# EAGLE design untitled (EAGLE 6.1)
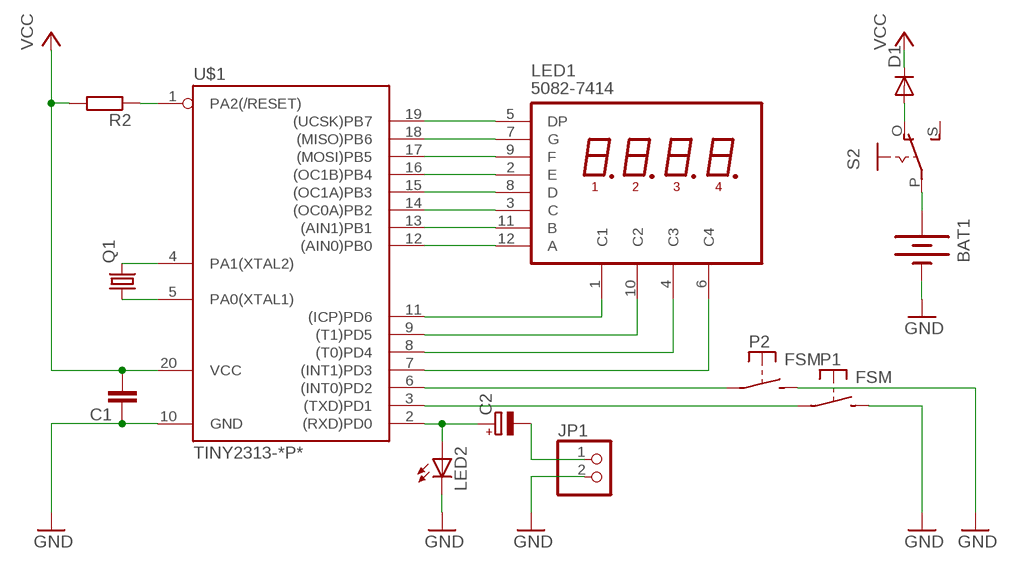
[diagram p0: schematic, sheet 1]

## Parts
BAT1  BATTERYAA-PANEL  [BATTERY-AA-PANEL]
C1  C-EU025-024X044  [C025-024X044]
C2  CPOL-EUE2,5-6E  [E2,5-6E]
D1  DIODE-D-5  [D-5]
JP1  PINHD-1X2  [1X02]
LED1  5082-7414  [5082-7414]
LED2  LED5MM  [LED5MM]
P1  FSM  [FSM]
P2  FSM  [FSM]
Q1  CRYSTALTC26H  [TC26H]
R2  R-EU_0204/7  [0204/7]
S2  EG1218S  [EG1218]
U$1  TINY2313-*P*  [DIL20]

## Nets
GND: BAT1.- C1.1 JP1.2 LED2.K(C) P1.P$2(S) P2.P$2(S) U$1.10(GND)
N$1: LED1.5(DP) U$1.19((UCSK)PB7)
N$2: LED1.7(G) U$1.18((MISO)PB6)
N$3: LED1.9(F) U$1.17((MOSI)PB5)
N$4: LED1.2(E) U$1.16((OC1B)PB4)
N$5: LED1.8(D) U$1.15((OC1A)PB3)
N$6: LED1.3(C) U$1.14((OC0A)PB2)
N$7: LED1.11(B) U$1.13((AIN1)PB1)
N$8: LED1.12(A) U$1.12((AIN0)PB0)
N$9: LED1.1(C1) U$1.11((ICP)PD6)
N$10: LED1.10(C2) U$1.9((T1)PD5)
N$11: LED1.4(C3) U$1.8((T0)PD4)
N$12: LED1.6(C4) U$1.7((INT1)PD3)
N$13: Q1.2 U$1.4(PA1(XTAL2))
N$14: Q1.1 U$1.5(PA0(XTAL1))
N$15: P2.P$1(P) U$1.6((INT0)PD2)
N$16: P1.P$1(P) U$1.3((TXD)PD1)
N$17: R2.1 U$1.1(PA2(/RESET))
N$18: BAT1.+ S2.P
N$19: C2.+ LED2.A U$1.2((RXD)PD0)
N$20: C2.- JP1.1
N$21: D1.A S2.O
VCC: C1.2 D1.C R2.2 U$1.20(VCC)
Unconnected: S2.S

## Library data of the parts
BAT1 = _MY_OWN_LIB:BATTERY: Battery Holders Various common sizes : AA, AAA, 20mm coin cell and 12mm coin cell.
C1 = rcl:C-EU: CAPACITOR, European symbol
C2 = rcl:CPOL-EU: POLARIZED CAPACITOR, European symbol
D1 = diode:DIODE-: DIODE
JP1 = pinhead:PINHD-1X2: PIN HEADER
LED1 = hp-displays:5082-7414: 4 digits X 7-segment + DP LED display
LED2 = led:LED: LED OSRAM: - CHIPLED LG R971, LG N971, LY N971, LG Q971, LY Q971, LO R971, LY R971 LH N974, LH R974 LS Q976, LO Q976, LY Q976 LO Q996 - Hyper CHIPLED LW Q18S LB Q993, LB Q99A, LB R99A - SideLED LS A670, LO A670, LY A670, LG A670, LP A670 LB A673, LV A673, LT A673, LW A673 LH A674 LY A675 LS A676, LA A676, LO A676, LY A676, LW A676 LS A679, LY A679, LG A679 - Hyper Micro SIDELED® LS Y876, LA Y876, LO Y876, LY Y876 LT Y87S - SmartLED LW L88C, LW L88S LB L89C, LB L89S, LG L890 LS L89K, LO L89K, LY L89K LS L896, LA L896, LO L896, LY L896 - TOPLED LS T670, LO T670, LY T670, LG T670, LP T670 LSG T670, LSP T670, LSY T670, LOP T670, LYG T670 LG T671, LOG T671, LSG T671 LB T673, LV T673, LT T673, LW T673 LH T674 LS T676, LA T676, LO T676, LY T676, LB T676, LH T676, LSB T676, LW T676 LB T67C, LV T67C, LT T67C, LS T67K, LO T67K, LY T67K, LW E67C LS E67B, LA E67B, LO E67B, LY E67B, LB E67C, LV E67C, LT E67C LW T67C LS T679, LY T679, LG T679 LS T770, LO T770, LY T770, LG T770, LP T770 LB T773, LV T773, LT T773, LW T773 LH T774 LS E675, LA E675, LY E675, LS T675 LS T776, LA T776, LO T776, LY T776, LB T776 LHGB T686 LT T68C, LB T68C - Hyper Mini TOPLED® LB M676 - Mini TOPLED Santana® LG M470 LS M47K, LO M47K, LY M47K Source: http://www.osram.convergy.de LUXEON: - LUMILED® LXK2-PW12-R00, LXK2-PW12-S00, LXK2-PW14-U00, LXK2-PW14-V00 LXK2-PM12-R00, LXK2-PM12-S00, LXK2-PM14-U00 LXK2-PE12-Q00, LXK2-PE12-R00, LXK2-PE12-S00, LXK2-PE14-T00, LXK2-PE14-U00 LXK2-PB12-K00, LXK2-PB12-L00, LXK2-PB12-M00, LXK2-PB14-N00, LXK2-PB14-P00, LXK2-PB14-Q00 LXK2-PR12-L00, LXK2-PR12-M00, LXK2-PR14-Q00, LXK2-PR14-R00 LXK2-PD12-Q00, LXK2-PD12-R00, LXK2-PD12-S00 LXK2-PH12-R00, LXK2-PH12-S00 LXK2-PL12-P00, LXK2-PL12-Q00, LXK2-PL12-R00 Source: www.luxeon.com KINGBRIGHT: KA-3528ASYC Source: www.kingbright.com
P1 P2 = switch-misc (2):FSM: TYCO SWITCH
Q1 = crystal:CRYSTAL: CRYSTAL; OC_FARNELL: unknown; OC_NEWARK: unknown
R2 = rcl:R-EU_: RESISTOR, European symbol
S2 = _MY_OWN_LIB:EG1218: SLIDING SWITCH 0.1" spacing through hole, vertical SPDT slide switch http://www.ladyada.net/library/pcb/eaglelibrary.html
U$1 = avr-7:TINY2313*: Atmel Tiny2313 2K Flash, 128 bytes EEPROM, 128 bytes RAM

## Board
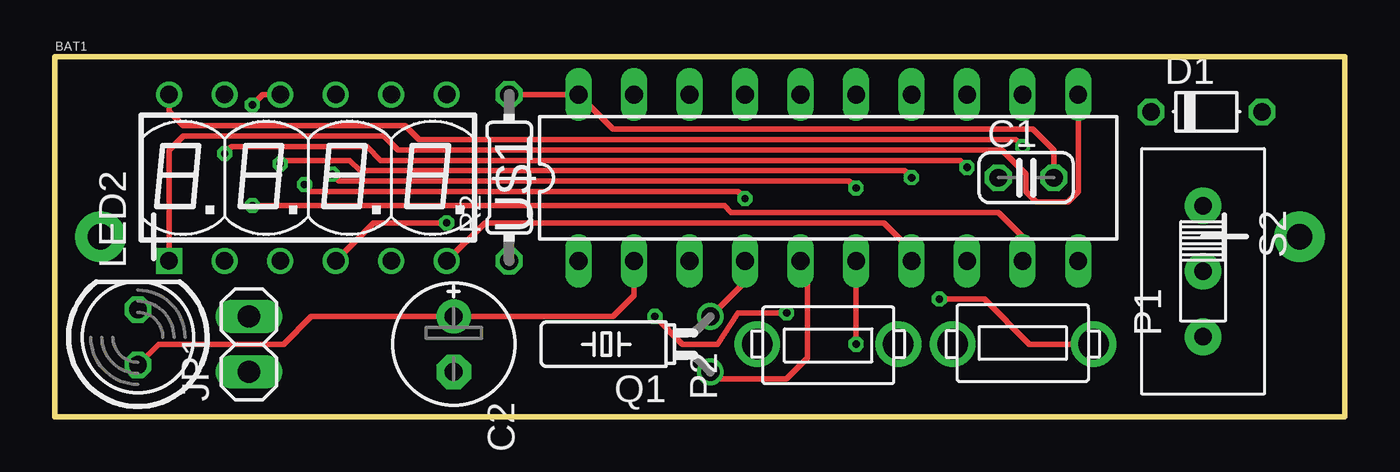
[diagram p1: board, top side]
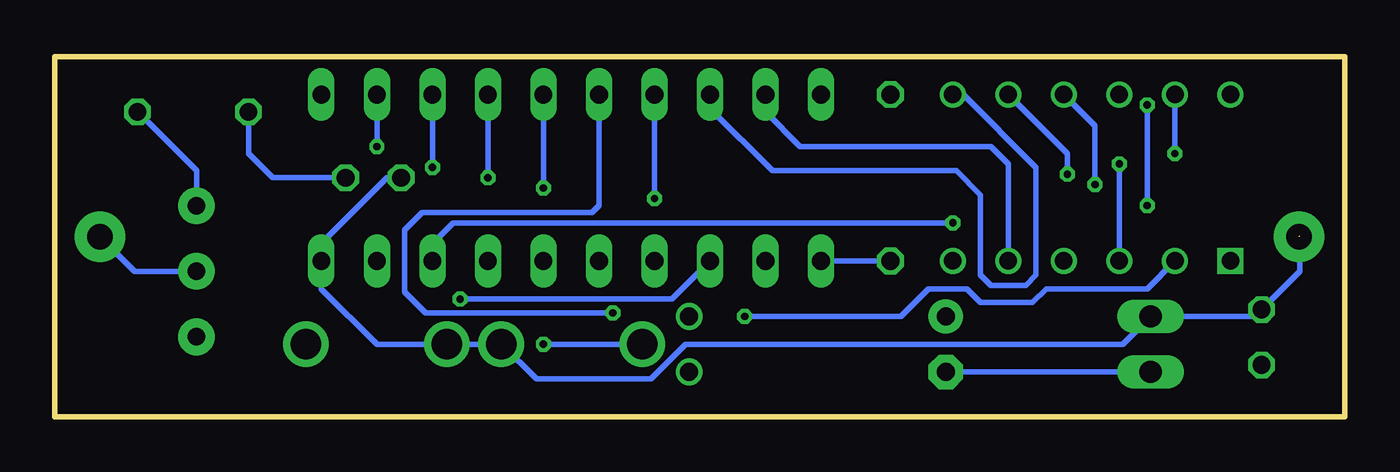
[diagram p2: board, bottom side, seen from below]

Size 59.03 x 16.5 mm. Coordinates in mm from the lower left corner, seen from the top.
Outline: 0,0 59.03,0 59.03,16.5 0,16.5 0,0
Copper layers (1*16): Top 0.0356mm / dielectric 1.5011mm / Bottom 0.0356mm
Design rules: minimum track width 6mil, minimum drill 13mil, track to track 6mil, track to pad 6mil, pad to pad 6mil, via to via 6mil, smd to smd 6mil, copper to edge 15mil, drill to drill 6mil, minimum pad ring 7mil, minimum via ring 7mil, stop-mask expansion 3mil, vias tented up to drill 0mil, thermal gap 10mil

### Footprints (pad centres in the part's own frame; a part is rotated, then mirrored left to right if it is on the bottom)
BATTERY-AA-PANEL = drill 1.17 pad 2.3: + 27.43,0; - -27.43,0
C025-024X044 = drill 0.813 octagon: 1 -1.27,0; 2 1.27,0
E2,5-6E = drill 0.813 pad 1.575: + -1.27,0 | drill 0.813 pad 1.575 octagon: - 1.27,0
D-5 = drill 0.813 octagon: A 2.54,0; C -2.54,0
1X02 = drill 1.016 long: 1 -1.27,0; 2 1.27,0
5082-7414 = drill 0.8 square: 1 0,0 | drill 0.8: 2 2.54,0; 3 5.08,0; 4 7.62,0; 5 10.16,0; 6 12.7,0; 7 12.7,7.62; 8 10.16,7.62; 9 7.62,7.62; 10 5.08,7.62; 11 2.54,7.62; 12 0,7.62
LED5MM = drill 0.813 octagon: A -1.27,0; K 1.27,0
FSM = drill 1.397: P$1 0,3.25; P$2 0,-3.2
TC26H = drill 0.813: 1 -1.27,0; 2 1.27,0
0204/7 = drill 0.813 octagon: 1 -3.81,0; 2 3.81,0
EG1218 = drill 0.8 pad 1.676: O -3,0; P 0,0; S 3,0
DIL20 = drill 0.813 long: 1 -11.43,-3.81; 2 -8.89,-3.81; 3 -6.35,-3.81; 4 -3.81,-3.81; 5 -1.27,-3.81; 6 1.27,-3.81; 7 3.81,-3.81; 8 6.35,-3.81; 9 8.89,-3.81; 10 11.43,-3.81; 11 11.43,3.81; 12 8.89,3.81; 13 6.35,3.81; 14 3.81,3.81; 15 1.27,3.81; 16 -1.27,3.81; 17 -3.81,3.81; 18 -6.35,3.81; 19 -8.89,3.81; 20 -11.43,3.81

### Placement (x,y rotation side)
BAT1  29.53,8.26 0 top
C1  44.45,10.95 0 top
C2  18.26,3.33 270 top
D1  52.7,13.97 0 top
JP1  8.89,3.33 90 top
LED1  5.24,7.14 0 top
LED2  3.81,3.65 90 top
P1  44.29,3.33 270 top
P2  35.4,3.33 90 top
Q1  30,3.33 90 top
R2  20.8,10.95 90 top
S2  52.55,6.67 270 top
U$1  35.4,10.95 0 top

### Tracks (layer width: path | path; a pad name or v marks a point on that pad's centre or on a via)
GND  (1 unrouted)
  Bottom 0.254: 2.06,8.26 2.06,6.67 LED2.K 4.13,4.6 JP1.2 10.16,3.33 30.16,3.33 31.75,1.75 36.99,1.75 38.58,3.33 P2.P$2 P1.P$2 44.29,3.33 46.83,5.87 U$1.10 46.83,7.94 43.81,10.95 C1.1
N$1
  Bottom 0.254: LED1.5 15.4,11.59 16.19,12.38 24.92,12.38 26.51,13.97 U$1.19
N$2
  Bottom 0.254: U$1.18 29.05,14.13 26.19,11.27 17.78,11.27 16.67,10.16 16.67,6.51 16.19,6.03 14.61,6.03 14.13,6.51 14.13,11.43 17.46,14.76 LED1.7
N$3  (via drill 0.33)
  Top 0.254: v31.59,10 31.27,10.32 11.75,10.32 v11.43,10.64
  Bottom 0.254: v31.59,10 U$1.17 | v11.43,10.64 11.43,13.34 LED1.9
N$4  (via drill 0.33)
  Top 0.254: v33.5,4.76 31.27,4.76 30.32,3.33 28.73,3.33 v27.46,4.6
  Bottom 0.254: U$1.16 34.13,9.68 34.45,9.37 42.23,9.37 43.02,8.57 43.02,5.71 42.07,4.76 v33.5,4.76 | LED1.2 9.05,5.87 13.65,5.87 14.29,5.24 16.67,5.24 17.3,5.87 19.05,5.87 20.32,4.6 v27.46,4.6
N$5  (via drill 0.33)
  Top 0.254: v36.67,10.48 36.35,10.79 13.02,10.79 v12.7,11.11
  Bottom 0.254: v36.67,10.48 U$1.15 | v12.7,11.11 12.7,12.06 LED1.8
N$6  (via drill 0.33)
  Top 0.254: v39.21,10.95 38.89,11.27 13.97,11.27 13.49,11.75 10.48,11.75 v10.32,11.59
  Bottom 0.254: LED1.3 v10.32,11.59 | v39.21,10.95 U$1.14
N$7  (via drill 0.33)
  Top 0.254: v7.78,12.06 8.1,12.38 14.29,12.38 14.92,11.75 41.43,11.75 v41.75,11.43
  Bottom 0.254: LED1.11 v7.78,12.06 | v41.75,11.43 U$1.13
N$8  (via drill 0.33)
  Top 0.254: v44.29,12.38 43.97,12.7 16.67,12.7 16.03,13.34 5.87,13.34 5.24,13.97 LED1.12
  Bottom 0.254: U$1.12 v44.29,12.38
N$9
  Top 0.254: LED1.1 5.24,12.22 5.87,12.86 15.08,12.86 15.72,12.22 43.34,12.22 44.45,11.11 44.45,10.32 44.93,9.84 46.35,9.84 46.83,10.32 U$1.11
N$10  (via drill 0.33)
  Top 0.254: LED1.10 9.53,14.76 v9.05,14.29 | v9.05,9.68 30.64,9.68 30.96,9.37 43.18,9.37 44.29,8.26 U$1.9
  Bottom 0.254: v9.05,14.29 v9.05,9.68
N$11  (via drill 0.33)
  Top 0.254: v17.94,8.89 14.61,8.89 LED1.4
  Bottom 0.254: U$1.8 41.75,7.94 40.8,8.89 v17.94,8.89
N$12
  Top 0.254: LED1.6 19.68,8.89 37.94,8.89 39.21,7.62 U$1.7
N$13
  Top 0.254: Q1.2 31.59,6.19 U$1.4
N$14
  Top 0.254: Q1.1 30.32,1.75 33.5,1.75 34.45,2.7 34.45,6.83 U$1.5
N$15  (via drill 0.33)
  Top 0.254: v36.67,3.33 U$1.6
  Bottom 0.254: P2.P$1 v36.67,3.33
N$16  (via drill 0.33)
  Top 0.254: P1.P$1 44.61,3.33 42.55,5.4 v40.48,5.4
  Bottom 0.254: U$1.3 30.8,5.4 v40.48,5.4
N$17
  Bottom 0.254: R2.1 U$1.1
N$18
  Bottom 0.254: S2.P 55.37,6.67 BAT1.+
N$19
  Top 0.254: U$1.2 26.51,5.56 25.56,4.6 C2.+ 11.75,4.6 10.48,3.33 4.76,3.33 LED2.A
N$20
  Bottom 0.254: JP1.1 C2.-
N$21
  Bottom 0.254: S2.O 52.55,11.27 D1.A
VCC
  Top 0.254: R2.2 U$1.20 25.56,13.18 44.77,13.18 45.72,12.22 C1.2
  Bottom 0.254: D1.C 50.16,12.06 49.05,10.95 C1.2